# Altium schematic sheet TestPoints.SchDoc: Test Points
size A3; DrawnBy: Hassan Alhujhoj, Abdullah Naeem; Address1: ECE Department; Address2: University of Canterbury; Address3: Christchurch 8041; Address4: New Zealand; Revision: 1
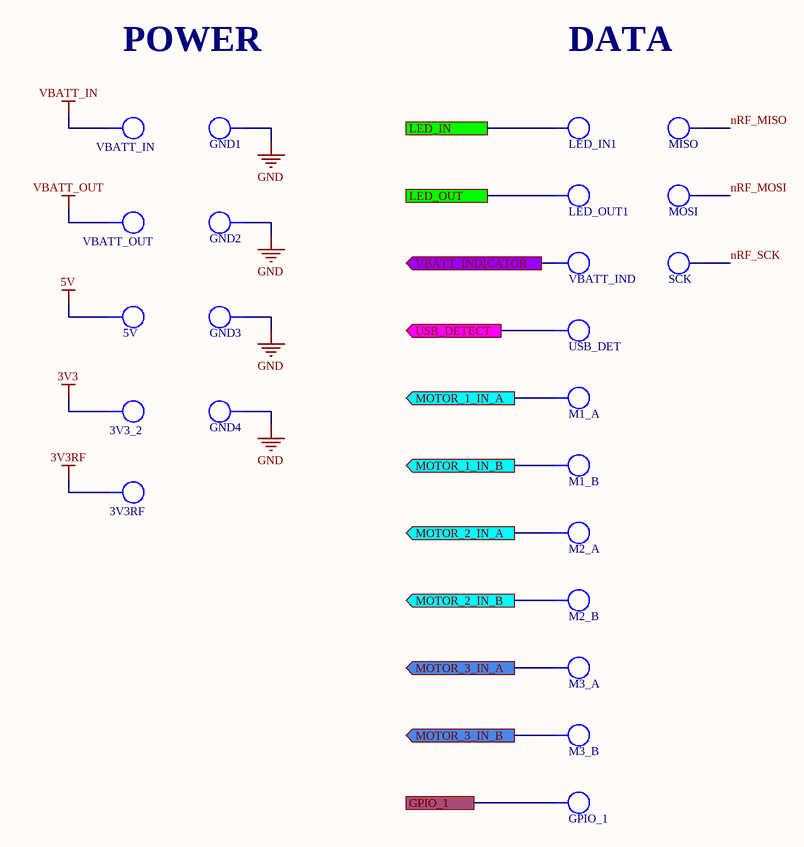
[diagram p0: TestPoints.SchDoc]

## Parts
3V3_2  TP  [TP_1206]  (value not drawn)  (no BOM)
3V3RF  TP  [TP_1206]  (value not drawn)  (no BOM)
5V  TP  [TP_1206]  (value not drawn)  (no BOM)
GND1  TP  [TP_1206]  (value not drawn)  (no BOM)
GND2  TP  [TP_1206]  (value not drawn)  (no BOM)
GND3  TP  [TP_1206]  (value not drawn)  (no BOM)
GND4  TP  [TP_1206]  (value not drawn)  (no BOM)
GPIO_1  TP  [TP_1206]  (value not drawn)  (no BOM)
LED_IN1  (no value)  [TP_0603]
LED_OUT1  TP  [TP_1206]  (value not drawn)  (no BOM)
M1_A  TP  [TP_1206]  (value not drawn)  (no BOM)
M1_B  TP  [TP_1206]  (value not drawn)  (no BOM)
M2_A  TP  [TP_1206]  (value not drawn)  (no BOM)
M2_B  TP  [TP_1206]  (value not drawn)  (no BOM)
M3_A  TP  [TP_1206]  (value not drawn)  (no BOM)
M3_B  TP  [TP_1206]  (value not drawn)  (no BOM)
MISO  TP_0603  [TP_0603]  (value not drawn)
MOSI  (no value)  [TP_0603]
SCK  (no value)  [TP_0603]
USB_DET  TP  [TP_1206]  (value not drawn)  (no BOM)
VBATT_IN  TP  [TP_1206]  (value not drawn)  (no BOM)
VBATT_IND  TP  [TP_1206]  (value not drawn)  (no BOM)
VBATT_OUT  TP  [TP_1206]  (value not drawn)  (no BOM)

## Ports
GPIO_1, LED_IN, LED_OUT, MOTOR_1_IN_A (out), MOTOR_1_IN_B (out), MOTOR_2_IN_A (out), MOTOR_2_IN_B (out), MOTOR_3_IN_A (out), MOTOR_3_IN_B (out), USB_DETECT (out), VBATT_INDICATOR (out)

## Nets
3V3: 3V3_2.1
3V3RF: 3V3RF.1
5V: 5V.1
GND: GND1.1 GND2.1 GND3.1 GND4.1
VBATT_IN: VBATT_IN.1
VBATT_OUT: VBATT_OUT.1
GPIO_1: GPIO_1.1 ; port GPIO_1
LED_IN: LED_IN1.1(TP) ; port LED_IN
LED_OUT: LED_OUT1.1 ; port LED_OUT
MOTOR_1_IN_A: M1_A.1 ; port MOTOR_1_IN_A
MOTOR_1_IN_B: M1_B.1 ; port MOTOR_1_IN_B
MOTOR_2_IN_A: M2_A.1 ; port MOTOR_2_IN_A
MOTOR_2_IN_B: M2_B.1 ; port MOTOR_2_IN_B
MOTOR_3_IN_A: M3_A.1 ; port MOTOR_3_IN_A
MOTOR_3_IN_B: M3_B.1 ; port MOTOR_3_IN_B
nRF_MISO: MISO.1(TP)
nRF_MOSI: MOSI.1(TP)
nRF_SCK: SCK.1(TP)
USB_DETECT: USB_DET.1 ; port USB_DETECT
VBATT_INDICATOR: VBATT_IND.1 ; port VBATT_INDICATOR

## Notes on the sheet
- POWER
- DATA
- Title
- Drawn by:
- Date:
- Time:
- Revision:
- Sheet
- of
- File:

## Library data of the parts
3V3_2 3V3RF 5V GND1-GND4 GPIO_1 LED_OUT1 M1_A M1_B M2_A M2_B M3_A M3_B USB_DET VBATT_IN VBATT_IND VBATT_OUT = TP_1206: Test-Point 3.3x1.6x2.1mm SMD; Manufacturer: Harwin Inc; Manufacturer Part Number: S1751-46R; Manufacturer PN: *; Storage Location: ProtoPlace; Mounting Type: Surface Mount; Type: PC Test Point; Supplier 1: Digi-Key; Supplier Part Number 1: 952-1478-2-ND; Supplier 2: Farnell; Supplier Part Number 2: 1826282; Supplier: ECE Dept; Value: TP
LED_IN1 MISO MOSI SCK = TP_0603: Test Point 1.65X0.9X1.2mm SMD; Manufacturer: TE Connectivity AMP Connectors; Manufacturer Part Number: 1625854-3; Mounting Type: Surface Mount; Type: PC Test Point; Supplier 1: Digi-Key; Supplier Part Number 1: A106145CT-ND; Terminal: 0.063" x 0.031" x 0.045" (1.60mm x 0.80mm x 1.15mm)